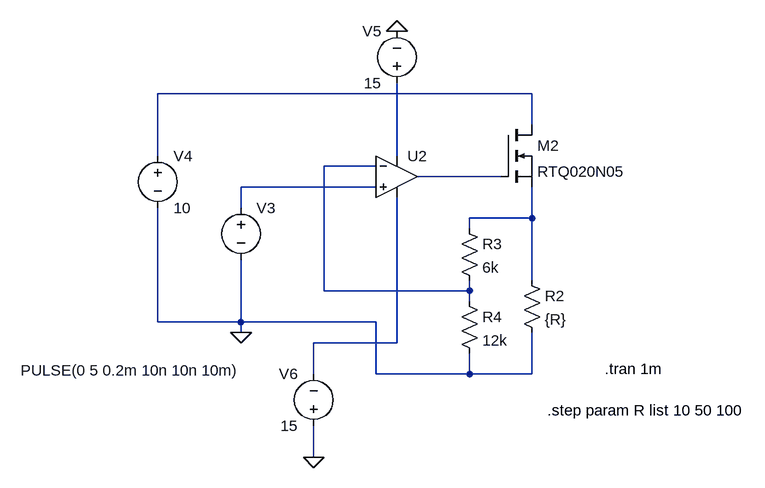
[diagram p0: schematic prof_12_seriese_regurator_opamp_mosfet.asc]
prof_12_seriese_regurator_opamp_mosfet.asc, the LTspice schematic file:
Version 4
SHEET 1 2184 2976
WIRE 1344 2400 768 2400
WIRE 1344 2448 1344 2400
WIRE 768 2496 768 2400
WIRE 1136 2496 1136 2384
WIRE 1104 2512 1024 2512
WIRE 1296 2528 1168 2528
WIRE 1104 2544 896 2544
WIRE 896 2576 896 2544
WIRE 1344 2592 1344 2544
WIRE 1344 2592 1248 2592
WIRE 1248 2608 1248 2592
WIRE 1344 2688 1344 2592
WIRE 1024 2704 1024 2512
WIRE 1248 2704 1248 2688
WIRE 1248 2704 1024 2704
WIRE 1248 2720 1248 2704
WIRE 768 2752 768 2576
WIRE 896 2752 896 2656
WIRE 896 2752 768 2752
WIRE 1104 2752 896 2752
WIRE 896 2768 896 2752
WIRE 1136 2784 1136 2560
WIRE 1136 2784 1008 2784
WIRE 1008 2832 1008 2784
WIRE 1104 2832 1104 2752
WIRE 1248 2832 1248 2800
WIRE 1248 2832 1104 2832
WIRE 1344 2832 1344 2768
WIRE 1344 2832 1248 2832
WIRE 1008 2960 1008 2912
FLAG 896 2768 0
FLAG 1008 2960 0
FLAG 1136 2304 0
SYMBOL voltage 896 2560 R0
WINDOW 3 -339 266 Left 2
SYMATTR Value PULSE(0 5 0.2m 10n 10n 10m)
SYMATTR InstName V3
SYMBOL voltage 768 2480 R0
SYMATTR InstName V4
SYMATTR Value 10
SYMBOL res 1232 2592 R0
SYMATTR InstName R3
SYMATTR Value 6k
SYMBOL res 1232 2704 R0
SYMATTR InstName R4
SYMATTR Value 12k
SYMBOL OpAmps/UniversalOpamp2 1136 2528 R0
SYMATTR InstName U2
SYMBOL voltage 1136 2400 R180
WINDOW 0 24 96 Left 2
WINDOW 3 24 16 Left 2
SYMATTR InstName V5
SYMATTR Value 15
SYMBOL voltage 1008 2928 R180
WINDOW 0 24 96 Left 2
WINDOW 3 24 16 Left 2
SYMATTR InstName V6
SYMATTR Value 15
SYMBOL res 1328 2672 R0
SYMATTR InstName R2
SYMATTR Value {R}
SYMBOL nmos 1296 2448 R0
SYMATTR InstName M2
SYMATTR Value RTQ020N05
TEXT 1456 2824 Left 2 !.tran 1m
TEXT 1368 2888 Left 2 !.step param R list 10 50 100

The netlist it stands for:
* prof_12_seriese_regurator_opamp_mosfet.asc
V3 N005 0 PULSE(0 5 0.2m 10n 10n 10m)
V4 N001 0 10
R3 N006 N003 6k
R4 N003 0 12k
XU2 N005 N003 N002 N007 N004 level.2 Avol=1Meg GBW=10Meg Slew=10Meg ilimit=25m rail=0 Vos=0 phimargin=45 en=0 enk=0 in=0 ink=0 Rin=500Meg  ; pins IN+ IN- V+ V- OUT
V5 N002 0 15
V6 0 N007 15
R2 N006 0 {R}
M2 N001 N004 N006 N006 RTQ020N05
.model NMOS NMOS
.model PMOS PMOS
.lib standard.mos
.tran 1m
.step param R list 10 50 100
.lib UniversalOpamps2.sub
.backanno
.end